# Altium schematic sheet Sheet1.SchDoc
size C
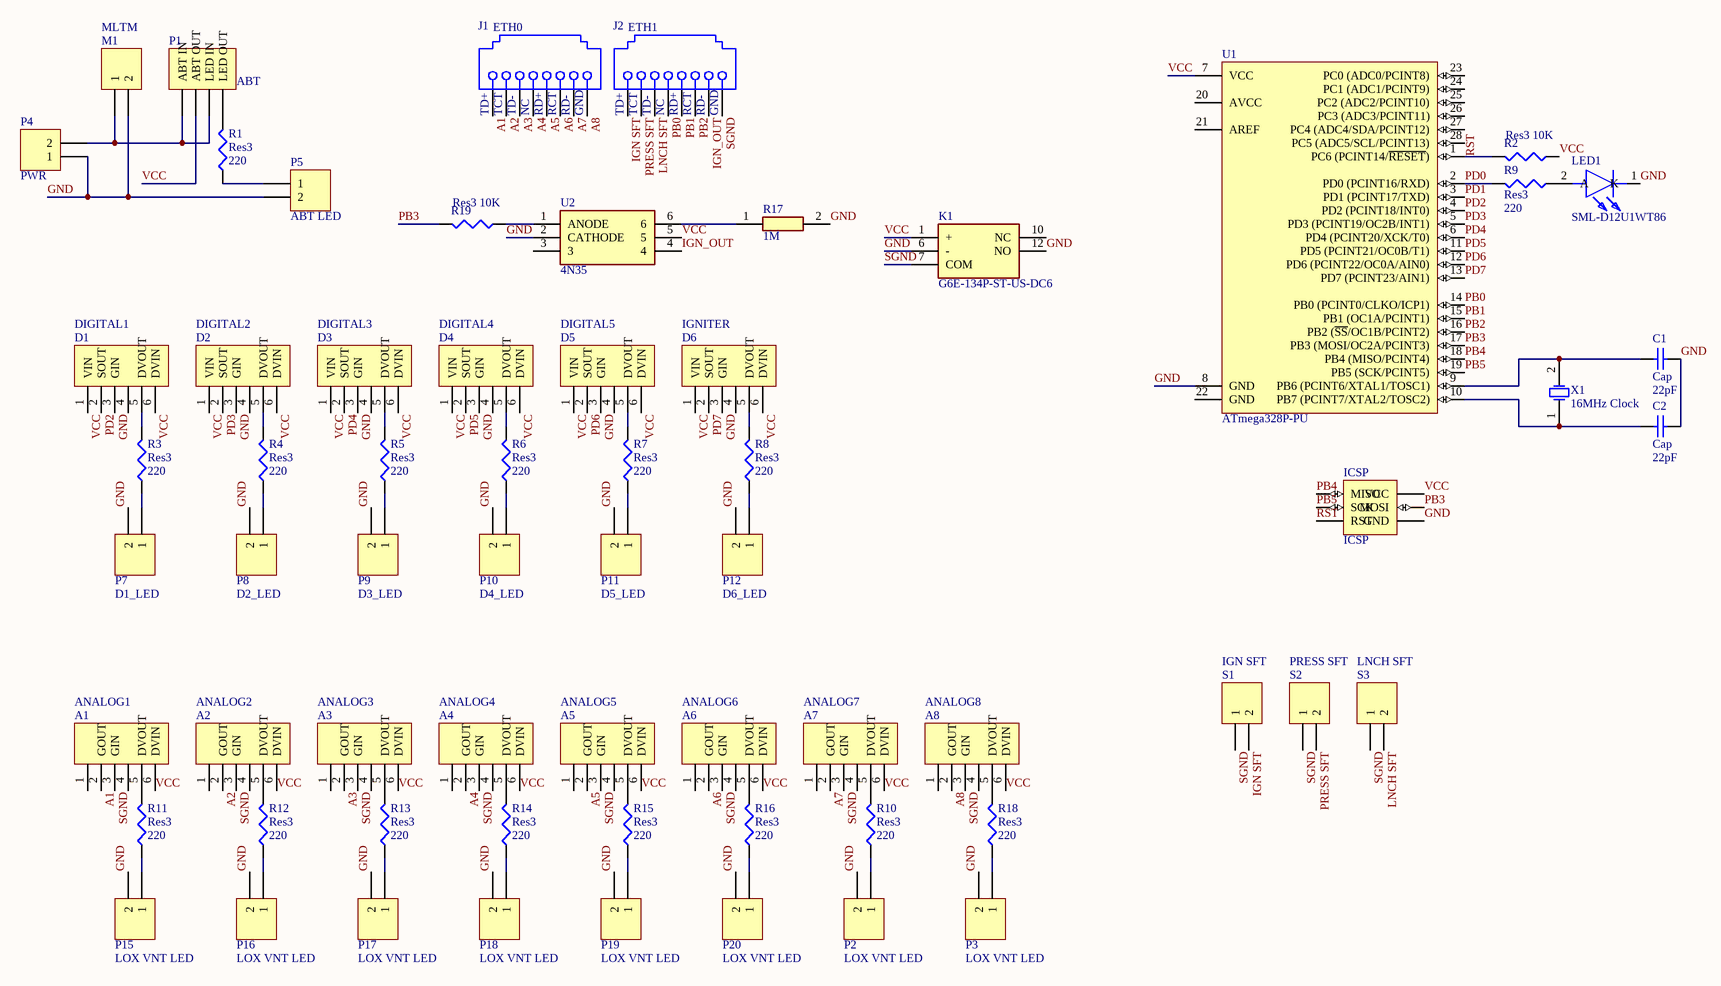
[diagram p0: Sheet1.SchDoc]

## Parts
A1  ANALOG1  [HDR1X6]
A2  ANALOG2  [HDR1X6]
A3  ANALOG3  [HDR1X6]
A4  ANALOG4  [HDR1X6]
A5  ANALOG5  [HDR1X6]
A6  ANALOG6  [HDR1X6]
A7  ANALOG7  [HDR1X6]
A8  ANALOG8  [HDR1X6]
C1  Cap  value 22pF  [RAD-0.3]
C2  Cap  value 22pF  [RAD-0.3]
D1  DIGITAL1  [HDR1X6]
D2  DIGITAL2  [HDR1X6]
D3  DIGITAL3  [HDR1X6]
D4  DIGITAL4  [HDR1X6]
D5  DIGITAL5  [HDR1X6]
D6  IGNITER  [HDR1X6]
ICSP  ICSP  [HDR2X3]
J1  ETH0  [TECO-5555153-1_V]
J2  ETH1  [TECO-5555153-1_V]
K1  G6E-134P-ST-US-DC6  [G6E-134P-US]
LED1  SML-D12U1WT86  [LEDC1608X65N]
M1  MLTM  [HDR1X2]
P1  ABT  [HDR1X4]
P2  LOX VNT LED  [HDR1X2]
P3  LOX VNT LED  [HDR1X2]
P4  PWR  [HDR1X2]
P5  ABT LED  [HDR1X2]
P7  D1_LED  [HDR1X2]
P8  D2_LED  [HDR1X2]
P9  D3_LED  [HDR1X2]
P10  D4_LED  [HDR1X2]
P11  D5_LED  [HDR1X2]
P12  D6_LED  [HDR1X2]
P15  LOX VNT LED  [HDR1X2]
P16  LOX VNT LED  [HDR1X2]
P17  LOX VNT LED  [HDR1X2]
P18  LOX VNT LED  [HDR1X2]
P19  LOX VNT LED  [HDR1X2]
P20  LOX VNT LED  [HDR1X2]
R1  Res3  value 220  [*RESC3146X60N]
R2  Res3  value 10K  [*RESC3146X60N]
R3  Res3  value 220  [*RESC3146X60N]
R4  Res3  value 220  [*RESC3146X60N]
R5  Res3  value 220  [*RESC3146X60N]
R6  Res3  value 220  [*RESC3146X60N]
R7  Res3  value 220  [*RESC3146X60N]
R8  Res3  value 220  [*RESC3146X60N]
R9  Res3  value 220  [*RESC3146X60N]
R10  Res3  value 220  [*RESC3146X60N]
R11  Res3  value 220  [*RESC3146X60N]
R12  Res3  value 220  [*RESC3146X60N]
R13  Res3  value 220  [*RESC3146X60N]
R14  Res3  value 220  [*RESC3146X60N]
R15  Res3  value 220  [*RESC3146X60N]
R16  Res3  value 220  [*RESC3146X60N]
R17  1M  [RESAD1550W60L630D230]
R18  Res3  value 220  [*RESC3146X60N]
R19  Res3  value 10K  [*RESC3146X60N]
S1  IGN SFT  [HDR1X2]
S2  PRESS SFT  [HDR1X2]
S3  LNCH SFT  [HDR1X2]
U1  ATmega328P-PU  [28P3]
U2  4N35  [DIP762W50P254L712H450Q6N]
X1  16MHz Clock  [CFM-HCM49-2_V]

## Nets
A1: A1.2(GOUT) J1.1
A2: A2.2(GOUT) J1.2
A3: A3.2(GOUT) J1.3
A4: A4.2(GOUT) J1.4
A5: A5.2(GOUT) J1.5
A6: A6.2(GOUT) J1.6
A7: A7.2(GOUT) J1.7
A8: A8.2(GOUT) J1.8
GND: C1.2 C2.2 D1.3(GIN) D2.3(GIN) D3.3(GIN) D4.3(GIN) D5.3(GIN) D6.3(GIN) ICSP.6(GND) K1.6(-) K1.12(NO) LED1.1(K) M1.2 P2.2 P3.2 P4.1 P5.2 P7.2 P8.2 P9.2 P10.2 P11.2 P12.2 P15.2 P16.2 P17.2 P18.2 P19.2 P20.2 R17.2 U1.8(GND) U2.2(CATHODE)
IGN SFT: J2.1 S1.2
IGN_OUT: J2.7 U2.4
LNCH SFT: J2.3 S3.2
PB0: J2.4 U1.14(PB0_(PCINT0/CLKO/ICP1))
PB1: J2.5 U1.15(PB1_(OC1A/PCINT1))
PB2: J2.6 U1.16(PB2_(~{SS}/OC1B/PCINT2))
PB3: ICSP.4(MOSI) R19.2 U1.17(PB3_(MOSI/OC2A/PCINT3))
PB4: ICSP.1(MISO) U1.18(PB4_(MISO/PCINT4))
PB5: ICSP.3(SCK) U1.19(PB5_(SCK/PCINT5))
PD0: R9.2 U1.2(PD0_(PCINT16/RXD))
PD1: U1.3(PD1_(PCINT17/TXD))
PD2: D1.2(SOUT) U1.4(PD2_(PCINT18/INT0))
PD3: D2.2(SOUT) U1.5(PD3_(PCINT19/OC2B/INT1))
PD4: D3.2(SOUT) U1.6(PD4_(PCINT20/XCK/T0))
PD5: D4.2(SOUT) U1.11(PD5_(PCINT21/OC0B/T1))
PD6: D5.2(SOUT) U1.12(PD6_(PCINT22/OC0A/AIN0))
PD7: D6.2(SOUT) U1.13(PD7_(PCINT23/AIN1))
PRESS SFT: J2.2 S2.2
RST: ICSP.5(RST) R2.2 U1.1(PC6_(PCINT14/~{RESET}))
SGND: A1.3(GIN) A2.3(GIN) A3.3(GIN) A4.3(GIN) A5.3(GIN) A6.3(GIN) A7.3(GIN) A8.3(GIN) J2.8 K1.7(COM) S1.1 S2.1 S3.1
VCC: A1.6(DVIN) A2.6(DVIN) A3.6(DVIN) A4.6(DVIN) A5.6(DVIN) A6.6(DVIN) A7.6(DVIN) A8.6(DVIN) D1.1(VIN) D1.6(DVIN) D2.1(VIN) D2.6(DVIN) D3.1(VIN) D3.6(DVIN) D4.1(VIN) D4.6(DVIN) D5.1(VIN) D5.6(DVIN) D6.1(VIN) D6.6(DVIN) ICSP.2(VCC) K1.1(+) P1.2(ABT_OUT) R2.1 U1.7(VCC) U2.5
NetA1_5: A1.5(DVOUT) R11.2
NetA2_5: A2.5(DVOUT) R12.2
NetA3_5: A3.5(DVOUT) R13.2
NetA4_5: A4.5(DVOUT) R14.2
NetA5_5: A5.5(DVOUT) R15.2
NetA6_5: A6.5(DVOUT) R16.2
NetA7_5: A7.5(DVOUT) R10.2
NetA8_5: A8.5(DVOUT) R18.2
NetC1_1: C1.1 U1.9(PB6_(PCINT6/XTAL1/TOSC1)) X1.2(X2)
NetC2_1: C2.1 U1.10(PB7_(PCINT7/XTAL2/TOSC2)) X1.1(X1)
NetD1_5: D1.5(DVOUT) R3.2
NetD2_5: D2.5(DVOUT) R4.2
NetD3_5: D3.5(DVOUT) R5.2
NetD4_5: D4.5(DVOUT) R6.2
NetD5_5: D5.5(DVOUT) R7.2
NetD6_5: D6.5(DVOUT) R8.2
NetLED1_2: LED1.2(A) R9.1
NetM1_1: M1.1 P1.1(ABT_IN) P1.3(LED_IN) P4.2
NetP1_4: P1.4(LED_OUT) R1.2
NetP2_1: P2.1 R10.1
NetP3_1: P3.1 R18.1
NetP5_1: P5.1 R1.1
NetP7_1: P7.1 R3.1
NetP8_1: P8.1 R4.1
NetP9_1: P9.1 R5.1
NetP10_1: P10.1 R6.1
NetP11_1: P11.1 R7.1
NetP12_1: P12.1 R8.1
NetP15_1: P15.1 R11.1
NetP16_1: P16.1 R12.1
NetP17_1: P17.1 R13.1
NetP18_1: P18.1 R14.1
NetP19_1: P19.1 R15.1
NetP20_1: P20.1 R16.1
NetR17_1: R17.1 U2.6
NetR19_1: R19.1 U2.1(ANODE)

Not connected (* = marked no-connect by the designer): A1 1 4; A2 1 4; A3 1 4; A4 1 4; A5 1 4; A6 1 4; A7 1 4; A8 1 4; D1 4; D2 4; D3 4; D4 4; D5 4; D6 4; J1 S1 S2; J2 S1 S2; K1 10(NC); U1 20(AVCC) 21(AREF) 22(GND) 23(PC0_(ADC0/PCINT8)) 24(PC1_(ADC1/PCINT9)) 25(PC2_(ADC2/PCINT10)) 26(PC3_(ADC3/PCINT11)) 27(PC4_(ADC4/SDA/PCINT12)) 28(PC5_(ADC5/SCL/PCINT13)); U2 3

## Notes on the sheet
- (in symbol CMP-2000-05640-1) TD+; TCT; TD-; NC; RD+; RCT; RD-; GND

## Library data of the parts
A1-A8 D1-D6 = Header 6: Header, 6-Pin; LatestRevisionDate: 17-Jul-2002; LatestRevisionNote: Re-released for DXP Platform.; Publisher: Altium Limited
C1 C2 = Cap: Capacitor; Published: 8-Jun-2000; LatestRevisionDate: 17-Jul-2002; LatestRevisionNote: Re-released for DXP Platform.; PackageReference: RAD-0.3; Publisher: Altium Limited; PackageDescription: Radial Cap, Thru-Hole; 2 Leads; 0.3 in Pin Spacing
ICSP = Header 3X2: Header, 3-Pin, Dual row; LatestRevisionDate: 17-Jul-2002; LatestRevisionNote: Re-released for DXP Platform.; Publisher: Altium Limited
J1 J2 = CMP-2000-05640-1: RJ45 Connector, Pitch 1.27 mm, 8 Position, Height 13.08 mm, Tail Length 3.81 mm, -40 to 85 degC, RoHS, Tray; Manufacturer: TE Connectivity; Number of Ports: 1; Shielding: Shielded; 3D Model: 5555153-1.pdf; Catalog Drawings: JackSideEntryRightAngle / JackSideEntryRightAngleTop; Ratings: Cat3; Connector Type: Jack; LED Color: DoesNotContainLED; Other Names: A31438; Tab Direction: Down; Number of Positions/Contacts: 8p8c(RJ45,Ethernet); Dynamic Catalog: ModularJacks; Contact Finish: Gold; Operating Temperature: -40°C~85°C; Contact Finish Thickness: 50µin(1.27µm); Datasheet URL: http://www.te.com/commerce/DocumentDelivery/DDEController?Action=srchrtrv&DocNm=5555153&DocType=Customer+Drawing&DocLang=English&DocFormat=pdf&PartCntxt=5555153-1; Mounting Type: ThroughHole; Package Reference: 5555153-1; RoHS Information: 5555153-1StatementofCompliance; Package Description: RJ45 Connector, Pitch 1.27 mm, 8 Position, Height 13.08 mm, Tail Length 3.81 mm; Family: ModularConnectors-Jacks; Orientation: 90°Angle(Right); Packaging: Tray; Number of Rows: 1; Mounting Technology: ThroughHole; Contact Material: PhosphorBronze; Manufacturer URL: http://www.te.com/; Datasheet Version: Rev. D2, 05/2016; Housing Material: PolybutyleneTerephthalate(PBT),Polyester; Features: BoardLock,PanelStops; Standard Package: 136; Termination: Solder; Category: Connectors,Interconnects
K1 = G6E-134P-ST-US-DC6: Relay or Contactor; Manufacturer_Name: Omron Electronics; Allied_Number: 70381892; Datasheet Link: http://omronfs.omron.com/en_US/ecb/products/pdf/en-g6e.pdf; Manufacturer_Part_Number: G6E-134P-ST-US-DC6; Mouser Part Number: 653-G6E134PSTUSDC6; Mouser Price/Stock: https://www.mouser.com/Search/Refine.aspx?Keyword=653-G6E134PSTUSDC6; Allied Price/Stock: https://www.alliedelec.com/omron-electronic-components-g6e-134p-st-us-dc6/70381892/
LED1 = SML-D12U1WT86: LED; Manufacturer_Name: ROHM Semiconductor; Datasheet Link: https://componentsearchengine.com/Datasheets/1/SML-D12U1WT86.pdf; Height: 0.65mm; Manufacturer_Part_Number: SML-D12U1WT86; Mouser Part Number: 755-SML-D12U1WT86; Mouser Price/Stock: https://www.mouser.com/Search/Refine.aspx?Keyword=755-SML-D12U1WT86; RS Part Number: 1332870; RS Price/Stock: http://uk.rs-online.com/web/p/products/1332870
M1 P2-P5 P7-P12 P15-P20 S1-S3 = Header 2: Header, 2-Pin; LatestRevisionDate: 17-Jul-2002; LatestRevisionNote: Re-released for DXP Platform.; Publisher: Altium Limited
P1 = Header 4: Header, 4-Pin; LatestRevisionDate: 17-Jul-2002; LatestRevisionNote: Re-released for DXP Platform.; Publisher: Altium Limited
R1-R16 R18 R19 = Res3: Resistor; Published: 8-Jun-2000; LatestRevisionDate: 29-May-2009; LatestRevisionNote: IPC-7351 Footprint Added.; PackageReference: J1-0603; Publisher: Altium Limited; PackageDescription: Chip Resistor
R17 = YR1B1M0CC: Resistor; Manufacturer_Name: TE Connectivity; Allied_Number: 70300029; Datasheet Link: http://www.te.com/commerce/DocumentDelivery/DDEController?Action=showdoc&DocId=Data+Sheet%7F1773265%7FA%7Fpdf%7FEnglish%7FENG_DS_1773265_A.pdf%7F2-1676913-7; Manufacturer_Part_Number: YR1B1M0CC; Mouser Part Number: 279-YR1B1M0CC; Mouser Price/Stock: https://www.mouser.com/Search/Refine.aspx?Keyword=279-YR1B1M0CC; RS Part Number: 1649061; RS Price/Stock: http://uk.rs-online.com/web/p/products/1649061; Allied Price/Stock: https://www.alliedelec.com/te-connectivity-yr1b1m0cc/70300029/
U1 = CMP-0095-00013-2: 8-bit AVR Microcontroller, 32KB Flash, 1KB EEPROM, 2KB SRAM, 28-pin PDIP, Industrial Grade (-40°C to 85°C); RevisionNote: DatasheetVersion updated. URLs added.; PackageVersion: revB, Sep-2001; DatasheetVersion: revD, May-2011; ComponentLink1Description: Manufacturer URL; ComponentLink1URL: http://www.atmel.com/; PackageReference: 28P3; ComponentLink2Description: ATmega48A/48PA/88A/88PA/168A/168PA/328/328P Datasheet; ComponentLink3URL: http://www.atmel.com/dyn/resources/prod_documents/8271S.pdf; ComponentLink2URL: http://www.atmel.com/dyn/resources/prod_documents/8271.pdf; ComponentLink3Description: ATmega48A/48PA/88A/88PA/168A/168PA/328/328P Summary
U2 = 4N35: Transistor; Manufacturer_Name: Isocom; Datasheet Link: http://uk.rs-online.com/web/p/products/597302; Height: 4.5mm; Manufacturer_Part_Number: 4N35; RS Part Number: 1712954; RS Price/Stock: http://uk.rs-online.com/web/p/products/1712954
X1 = CMP-1215-00001-1: At-Cut Crystal Unit, 3.5 to 30 MHz, -40 to 85 degC, 2-Pin 11.4Ã—4.7Ã—4.3 mm SMD, RoHS, Reel; Manufacturer: Citizen Finetech Miyota; PartNumber: HCM49-8.000MABJ-UT; DL: 100 uW; C0: 7 pF Max.; R1: 50 to 200 Ohm; IR: 500 MOhm Min.; f0: 3.5 to 30 MHz; Mounting Technology: Surface Mount; Packing: Reel; ComponentLink2URL: http://cfm.citizen.co.jp/english/product/pdf/HCM49.pdf; Operating Temperature: -40 to 85 degC; ComponentLink3URL: http://cfm.citizen.co.jp/english/product/pdf/HCM49.pdf; ComponentLink2Description: Datasheet; ComponentLink3Description: Package Specification; ComponentLink1Description: Manufacturer URL; PackageDescription: 2-Pin Surface Mount, Body 11.4 x 4.7 mm, Pitch 8.5 mm; DatasheetVersion: Jan-12; RoHS: TRUE; ComponentLink1URL: http://cfm.citizen.co.jp/english/index.html